# Altium schematic sheet LDO EC25.SchDoc
size A; SheetNumber: 2; SheetTotal: 9
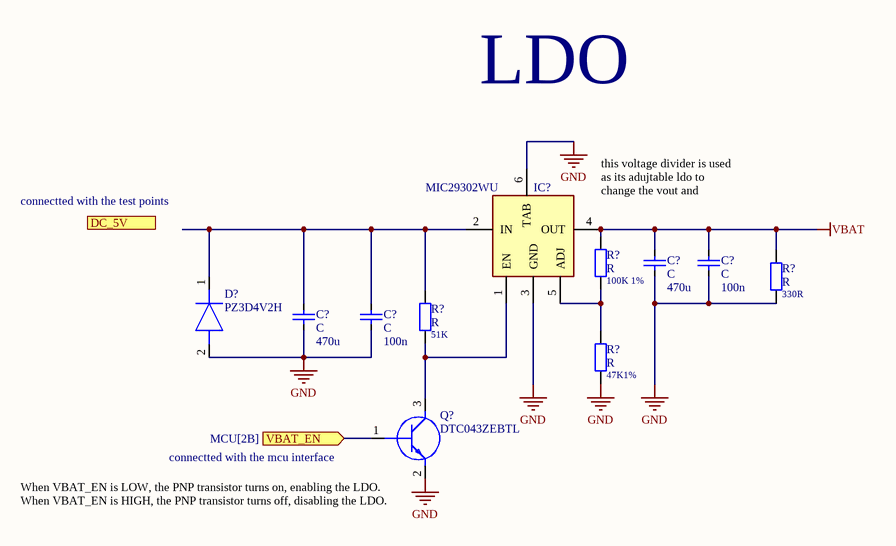
[diagram p0: LDO EC25.SchDoc]

## Parts
(Parts that share a designator on the sheet are numbered #1, #2 ... from top to bottom, then left to right.)
C?#1  C  value 470u  [CAPC1005X06N]
C?#2  C  value 100n  [CAPC1005X06N]
C?#3  C  value 470u  [CAPC1005X06N]
C?#4  C  value 100n  [CAPC1005X06N]
D?  PZ3D4V2H  [PZ3D4V2H]
IC?  MIC29302WU  [MIC29302WU]
Q?  DTC043ZEBTL  [SOTFL50P160X85-3N]
R?#1  R  value 100K 1%  [RESC1005X04N]
R?#2  R  value 330R  [RESC1005X04N]
R?#3  R  value 51K  [RESC1005X04N]
R?#4  R  value 47K1%  [RESC1005X04N]

## Ports
DC_5V (in), VBAT_EN (in, see MCU[2B])

## Nets
GND: C?#1.1 C?#2.1 C?#3.1 C?#4.1 D?.2(A) IC?.3(GND) IC?.6(TAB) Q?.2(E) R?#2.1 R?#4.1
VBAT: C?#1.2 C?#2.2 IC?.4(OUT) R?#1.2 R?#2.2
VBAT_EN: Q?.1(B) ; port VBAT_EN
NetC?#3_2: C?#3.2 C?#4.2 D?.1(K) IC?.2(IN) R?#3.2
NetIC?_1: IC?.1(EN) Q?.3(C) R?#3.1
NetIC?_5: IC?.5(ADJ) R?#1.1 R?#4.2

## Notes on the sheet
- LDO
- connectted with the test points
- (near IC?) this voltage divider is used as its adujtable ldo to change the vout and following the equation shown in the data sheet
- (near Q?) connectted with the mcu interface
- (near Q?) When VBAT_EN is LOW, the PNP transistor turns on, enabling the LDO.
  When VBAT_EN is HIGH, the PNP transistor turns off, disabling the LDO.

## Library data of the parts
D? = PZ3D4V2H: Diode; Manufacturer_Name: Prisemi; Datasheet Link: http://www.prisemi.com/UploadImage/files/Zener/PZ3D4V2H.pdf; Height: 1mm; Manufacturer_Part_Number: PZ3D4V2H
IC? = MIC29302WU: Integrated Circuit; Manufacturer_Name: Microchip; Datasheet Link: https://www.mouser.in/datasheet/2/268/MIC2915x_30x_50x_75x_High_Current_Low_Dropout_Regu-1889172.pdf; Height: 5.08mm; Manufacturer_Part_Number: MIC29302WU; Mouser Part Number: 998-MIC29302WU; Mouser Price/Stock: https://www.mouser.co.uk/ProductDetail/Microchip-Technology/MIC29302WU?qs=kh6iOki%2FeLGH5fS1ZBQ3pA%3D%3D; Arrow Part Number: MIC29302WU; Arrow Price/Stock: https://www.arrow.com/en/products/mic29302wu/microchip-technology?region=nac
Q? = DTC043ZEBTL: Transistor BJT NPN; Manufacturer_Name: ROHM Semiconductor; Datasheet Link: http://rohmfs.rohm.com/en/products/databook/datasheet/discrete/transistor/digital/dtc043zmt2l-e.pdf; Height: 0.85mm; Manufacturer_Part_Number: DTC043ZEBTL; Mouser Part Number: 755-DTC043ZEBTL; Mouser Price/Stock: https://www.mouser.co.uk/ProductDetail/ROHM-Semiconductor/DTC043ZEBTL?qs=n7vHx8wJlDGyWrBOh0icRQ%3D%3D
C?#1-C?#4 = C: MPN: *; Link: *
R?#1-R?#4 = R: MPN: *; Link: *